# Altium schematic sheet [05] - CPU - PCIE.SchDoc
size A2; DocumentNumber: 5; SheetNumber: 5; SheetTotal: 20
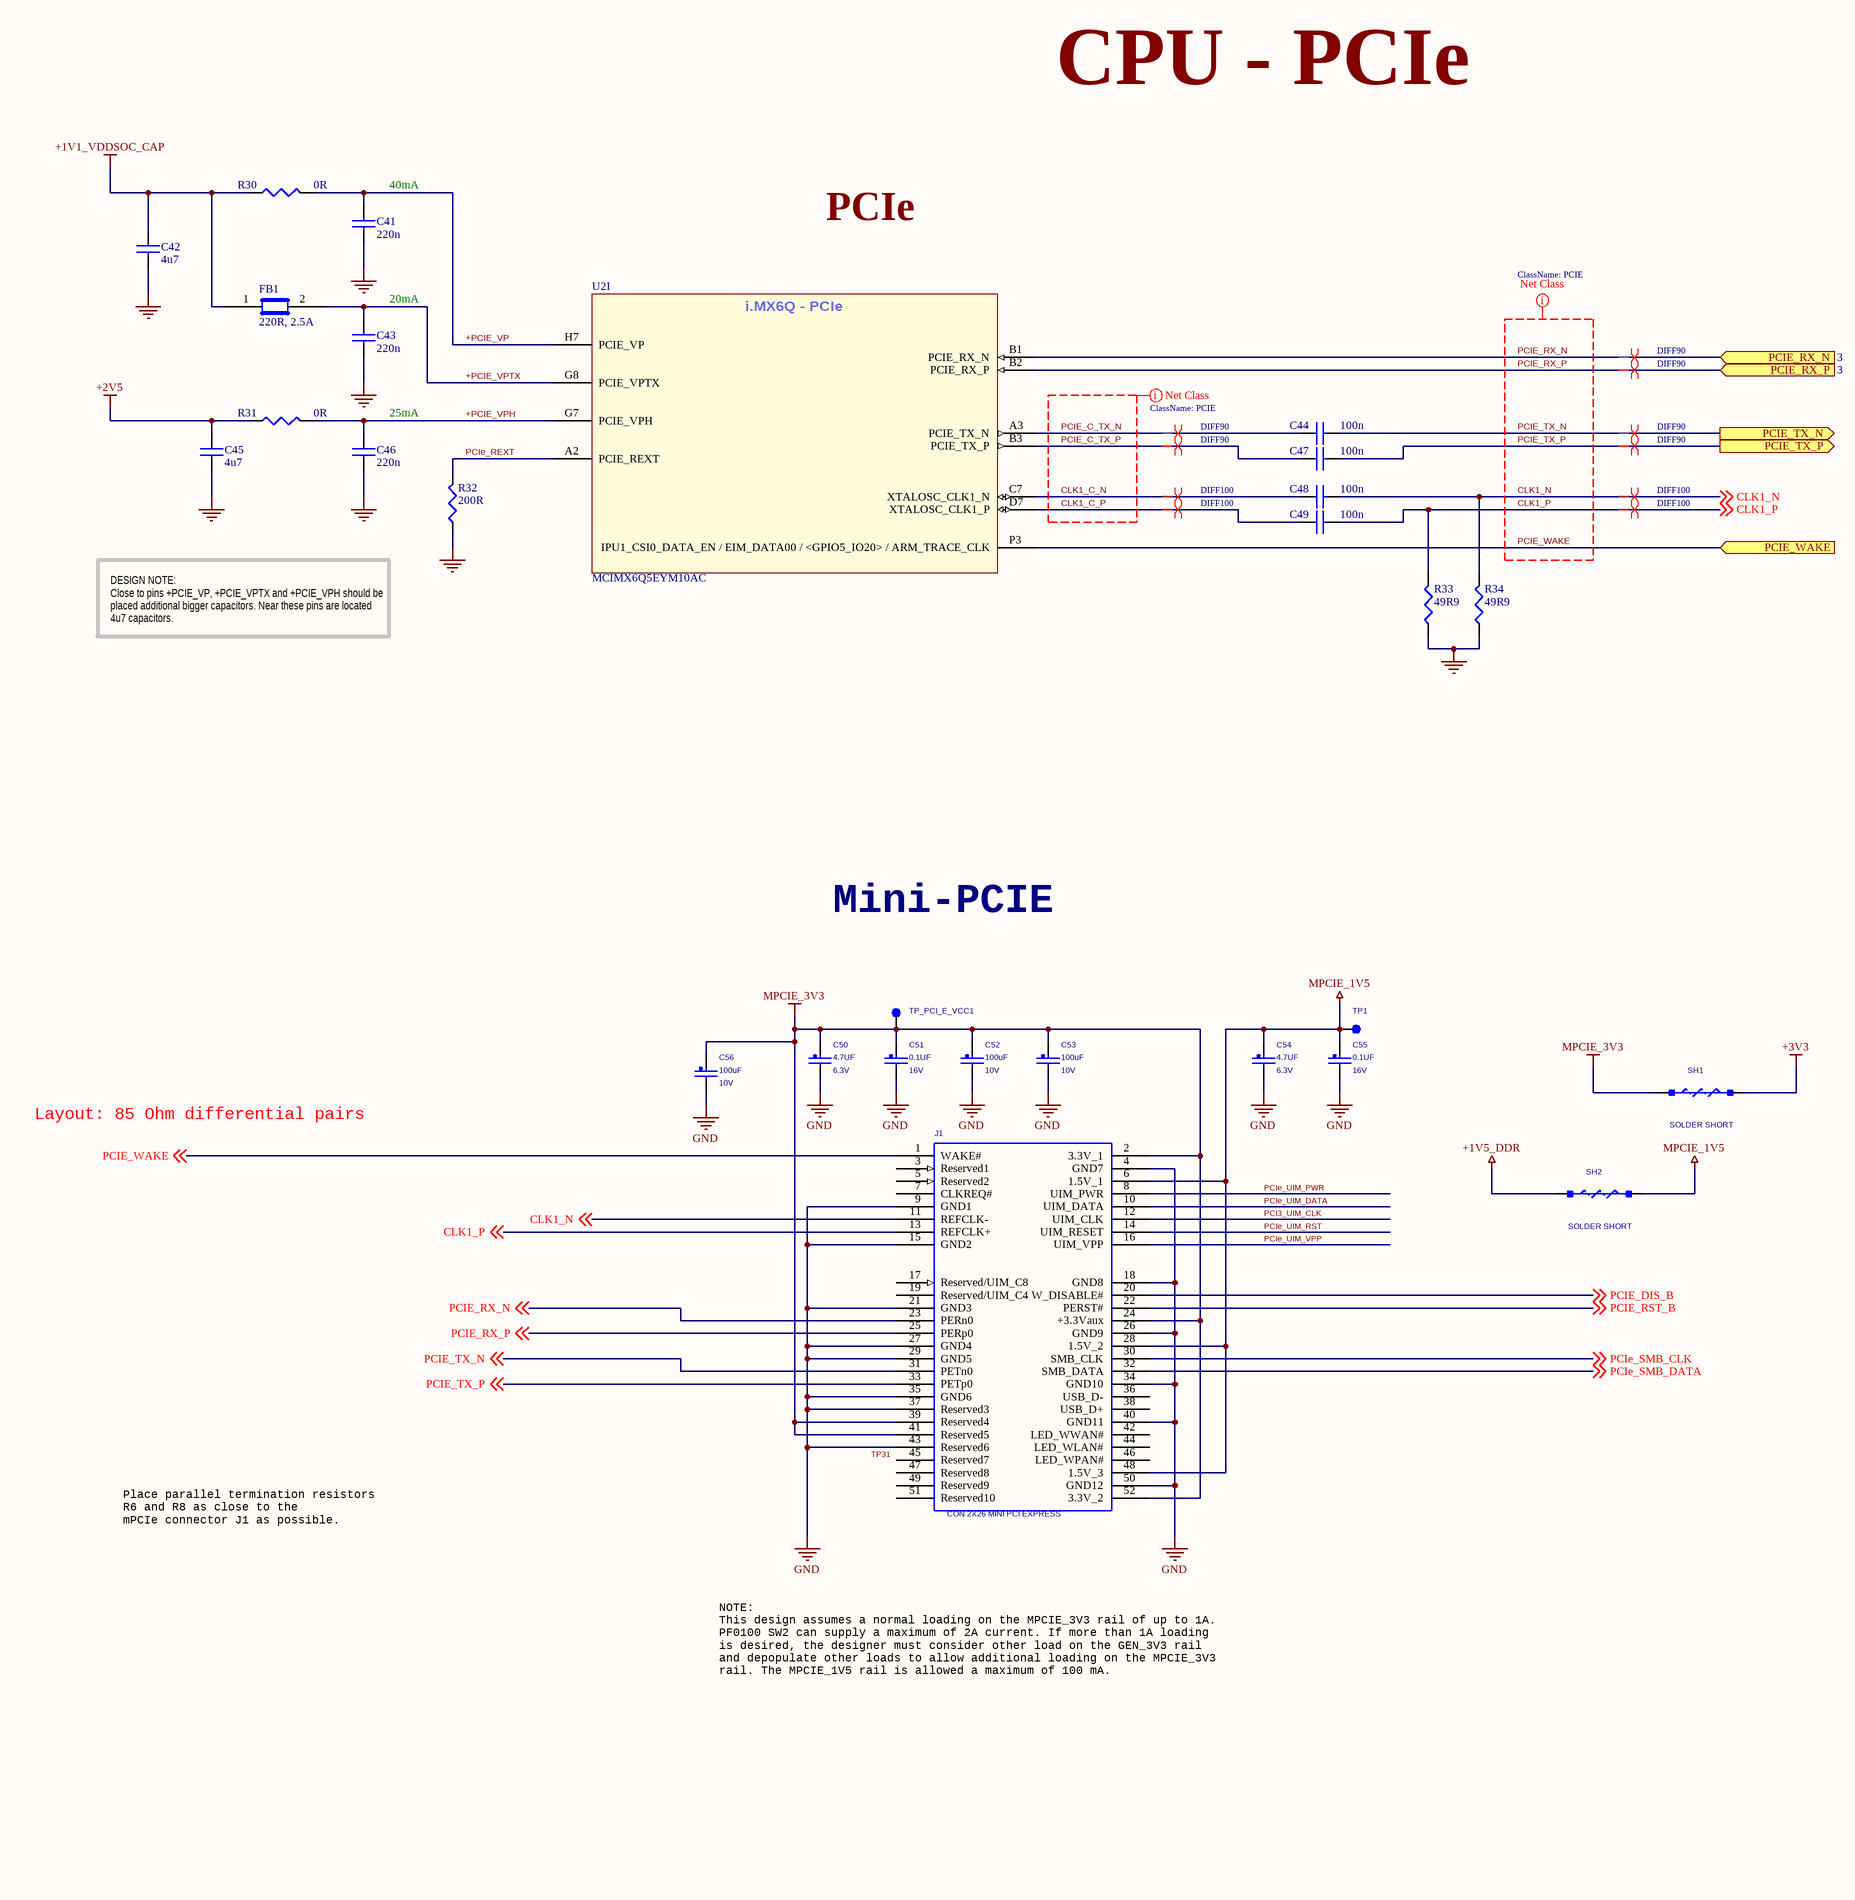
[diagram p0: [05] - CPU - PCIE.SchDoc, left]
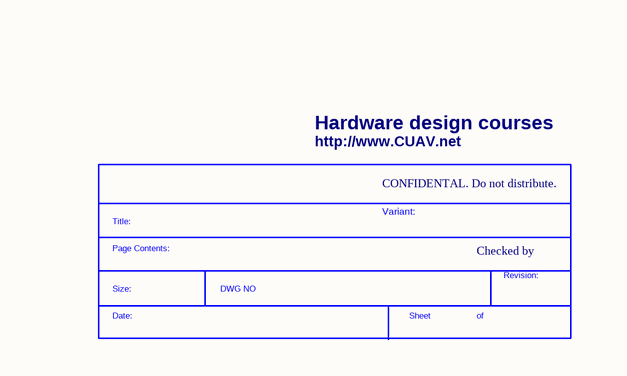
[diagram p1: [05] - CPU - PCIE.SchDoc, right]

## Parts
*  SDTitleBlock  (value not drawn)  (graphical)
C41  220n  [C0402]
C42  4u7  [0603c]
C43  220n  [C0402]
C44  100n  [C0402]
C45  4u7  [C0402]
C46  220n  [C0402]
C47  100n  [C0402]
C48  100n  [0402cap]
C49  100n  [0402cap]
C50  4.7UF  WVDC: 6.3V  [0603c]
C51  0.1UF  WVDC: 16V  [0402_CC]
C52  100uF  WVDC: 10V  [1206_CC]
C53  100uF  WVDC: 10V  [1206_CC]
C54  4.7UF  WVDC: 6.3V  [0603c]
C55  0.1UF  WVDC: 16V  [0402cap]
C56  100uF  WVDC: 10V  [1206_CC]
FB1  220R, 2.5A  [0402r]
J1  CON 2X26 MINI PCI EXPRESS  [0679100002]
R30  0R  [R0402]
R31  0R  [R0402]
R32  200R  [R0402]
R33  49R9  [R0402]
R34  49R9  [R0402]
SH1  SOLDER SHORT  [0805L]
SH2  SOLDER SHORT  [0805L]
TP1  TEST POINT  [C035S]  (value not drawn)
TP_PCI_E_VCC1  TEST POINT  [C035S]  (value not drawn)
U2  MCIMX6Q5EYM10AC  [PBGA624]  (part I of 15)

## Ports
PCIE_RX_N (in, see 3), PCIE_RX_P (in, see 3), PCIE_TX_N (out), PCIE_TX_P (out), PCIE_WAKE (in)

## Nets
+1V1_VDDSOC_CAP: C42.1 FB1.1 R30.1
+1V5_DDR: SH2.1
+2V5: C45.1 R31.1
+3V3: SH1.2
GND: C41.2 C42.2 C43.2 C45.2 C46.2 C50.2 C51.2 C52.2 C53.2 C54.2 C55.2 C56.2 J1.4(GND7) J1.9(GND1) J1.15(GND2) J1.18(GND8) J1.21(GND3) J1.26(GND9) J1.27(GND4) J1.29(GND5) J1.34(GND10) J1.35(GND6) J1.37(Reserved3) J1.40(GND11) J1.43(Reserved6) J1.50(GND12) R32.1 R33.1 R34.1
MPCIE_1V5: C54.1 C55.1 J1.6(1.5V_1) J1.28(1.5V_2) J1.48(1.5V_3) SH2.2 TP1.1(Pin1)
MPCIE_3V3: C50.1 C51.1 C52.1 C53.1 C56.1 J1.2(3.3V_1) J1.24(+3.3Vaux) J1.39(Reserved4) J1.41(Reserved5) J1.52(3.3V_2) SH1.1 TP_PCI_E_VCC1.1(Pin1)
+PCIE_VP: C41.1 R30.2 U2.H7(PCIE_VP)
+PCIE_VPH: C46.1 R31.2 U2.G7(PCIE_VPH)
+PCIE_VPTX: C43.1 FB1.2 U2.G8(PCIE_VPTX)
CLK1_C_N: C48.1 U2.C7(XTALOSC_CLK1_N)
CLK1_C_P: C49.1 U2.D7(XTALOSC_CLK1_P)
CLK1_N: C48.2 J1.11(REFCLK-) R34.2 ; off-sheet CLK1_N
CLK1_P: C49.2 J1.13(REFCLK+) R33.2 ; off-sheet CLK1_P
PCI3_UIM_CLK: J1.12(UIM_CLK)
PCIE_C_TX_N: C44.1 U2.A3(PCIE_TX_N)
PCIE_C_TX_P: C47.1 U2.B3(PCIE_TX_P)
PCIE_DIS_B: J1.20(W_DISABLE#) ; off-sheet PCIE_DIS_B
PCIe_REXT: R32.2 U2.A2(PCIE_REXT)
PCIE_RST_B: J1.22(PERST#) ; off-sheet PCIE_RST_B
PCIE_RX_N: J1.23(PERn0) U2.B1(PCIE_RX_N) ; off-sheet PCIE_RX_N, port PCIE_RX_N
PCIE_RX_P: J1.25(PERp0) U2.B2(PCIE_RX_P) ; off-sheet PCIE_RX_P, port PCIE_RX_P
PCIe_SMB_CLK: J1.30(SMB_CLK) ; off-sheet PCIe_SMB_CLK
PCIe_SMB_DATA: J1.32(SMB_DATA) ; off-sheet PCIe_SMB_DATA
PCIE_TX_N: C44.2 J1.31(PETn0) ; off-sheet PCIE_TX_N, port PCIE_TX_N
PCIE_TX_P: C47.2 J1.33(PETp0) ; off-sheet PCIE_TX_P, port PCIE_TX_P
PCIe_UIM_DATA: J1.10(UIM_DATA)
PCIe_UIM_PWR: J1.8(UIM_PWR)
PCIe_UIM_RST: J1.14(UIM_RESET)
PCIe_UIM_VPP: J1.16(UIM_VPP)
PCIE_WAKE: J1.1(WAKE#) U2.P3(IPU1_CSI0_DATA_EN_/_EIM_DATA00_/_<GPIO5_IO20>_/_ARM_TRACE_CLK) ; off-sheet PCIE_WAKE, port PCIE_WAKE

Not connected (* = marked no-connect by the designer): J1 3(Reserved1) 5(Reserved2) 7(CLKREQ#) 17(Reserved/UIM_C8) 19(Reserved/UIM_C4) 36(USB_D-) 38(USB_D+) 42(LED_WWAN#) 44(LED_WLAN#) 45(Reserved7) 46(LED_WPAN#) 47(Reserved8) 49(Reserved9) 51(Reserved10)

## Layout directives
differential pair; net class DIFF100: CLK1_C_N, CLK1_C_P, CLK1_N, CLK1_P
differential pair; net class DIFF90: PCIE_C_TX_N, PCIE_C_TX_P, PCIE_RX_N, PCIE_RX_P, PCIE_TX_N, PCIE_TX_P
net class PCIE: CLK1_C_N, CLK1_C_P, CLK1_N, CLK1_P, PCIE_C_TX_N, PCIE_C_TX_P, PCIE_RX_N, PCIE_RX_P, PCIE_TX_N, PCIE_TX_P, PCIE_WAKE

## Notes on the sheet
- CPU - PCIe
- (near C41) 40mA
- PCIe
- (near C43) 20mA
- (near C46) 25mA
- DESIGN NOTE:
  Close to pins +PCIE_VP, +PCIE_VPTX and +PCIE_VPH should be placed additional bigger capacitors. Near these pins are located 4u7 capacitors.
- Mini-PCIE
- Layout: 85 Ohm differential pairs
- Place parallel termination resistors
  R6 and R8 as close to the
  mPCIe connector J1 as possible.
- NOTE:
  This design assumes a normal loading on the MPCIE_3V3 rail of up to 1A.
  PF0100 SW2 can supply a maximum of 2A current. If more than 1A loading
  is desired, the designer must consider other load on the GEN_3V3 rail
  and depopulate other loads to allow additional loading on the MPCIE_3V3
  rail. The MPCIE_1V5 rail is allowed a maximum of 100 mA.
- Hardware design courses
- http://www.CUAV.net
- CONFIDENTAL. Do not distribute.
- CLOCKS (CPU & PCIE)
- Variant:
- Checked by
- Labels drawn without touching a wire or pin: TP31
- (in symbol MCIMX6Q5EYM10AC, part I) i.MX6Q - PCIe
- (in symbol SDTitleBlock) Title:; Page Contents:; Revision:; Size:; DWG NO; Date:; Sheet; of

## Library data of the parts
C41 C43 C46 = C1005X5R1E224M: CAP CER .22UF 25V X5R 20% 0402; Manufacturer: TDK Corporation; Capacitance: 0.22礔; Value: 220nF; .Checked PCB: used; Tolerance: ?0%; Category: Capacitors; Supplier Part Number: 445-5945-1-ND; Manufacturer Part Number: C1005X5R1E224M; Operating Temperature: -55癈 ~ 85癈; Package / Case: 0402 (1005 Metric); Price 1k [$]: 0.02600; .Checked SCH: used; Voltage - Rated: 25V; Supplier: Digikey; Supplier 1: Digi-Key; Supplier Part Number 1: 445-5945-1-ND; RoHS: RoHS Compliant; Stock 1: 54593; Pricing 1: 1=0.3, 10=0.2, 100=0.08, 250=0.05752, 500=0.041, 1000=0.03 (USD); Temperature Coefficient: X5R; Mounting Type: Surface Mount, MLCC; Applications: General Purpose; Ratings: -; Size / Dimension: 0.039" L x 0.020" W (1.00mm x 0.50mm); Height - Seated (Max): -; Thickness (Max): 0.022" (0.55mm); Lead Spacing: -; Features: -; Packaging: Cut Tape (CT); Lead Style: -; ComponentLink1URL: http://www.tdk.co.jp/tefe02/e412_c.pdf; ComponentLink1Description: http://www.tdk.co.jp/tefe02/e412_c.pdf
C42 C45 = C1005X5R1A475M: CAP CER 4.7UF 10V 20% X5R 0402; Manufacturer: TDK Corporation; Capacitance: 4.7礔; Tolerance: ?0%; .Checked PCB: RF; Supplier 1: Digi-Key; Supplier Part Number 1: 445-8023-1-ND; Manufacturer Part Number: C1005X5R1A475M; RoHS: RoHS Compliant; Category: Capacitors; Stock 1: 10140; Pricing 1: 1=0.53, 10=0.415, 100=0.25, 250=0.18752, 500=0.16, 1000=0.125, 5000=0.095 (USD); Voltage - Rated: 10V; Temperature Coefficient: X5R; Mounting Type: Surface Mount, MLCC; Operating Temperature: -55癈 ~ 85癈; Applications: General Purpose; Ratings: -; Package / Case: 0402 (1005 Metric); Size / Dimension: 0.039" L x 0.020" W (1.00mm x 0.50mm); Height - Seated (Max): -; Thickness (Max): -; Lead Spacing: -; Features: -; Packaging: Cut Tape (CT); Lead Style: -; ComponentLink1URL: http://www.tdk.com/pdf/general_B11.pdf; ComponentLink1Description: http://www.tdk.com/pdf/general_B11.pdf; .Checked SCH: RF
C44 C47-C49 = C1005X5R1H104K: CAP CER .10UF 50V X5R 10% 0402; Manufacturer: TDK Corporation; Capacitance: 0.1礔; Value: 100nF; .Checked PCB: used; Tolerance: ?0%; Category: Capacitors; Supplier Part Number: 445-5942-1-ND; Manufacturer Part Number: C1005X5R1H104K; Operating Temperature: -55癈 ~ 85癈; Package / Case: 0402 (1005 Metric); Price 1k [$]: 0.02340; .Checked SCH: used; Voltage - Rated: 50V; Supplier: Digikey; Supplier 1: Digi-Key; Supplier Part Number 1: 445-5942-1-ND; RoHS: RoHS Compliant; Stock 1: 106926; Pricing 1: 1=0.27, 10=0.18, 100=0.072, 250=0.05176, 500=0.0369, 1000=0.027 (USD); Temperature Coefficient: X5R; Mounting Type: Surface Mount, MLCC; Applications: General Purpose; Ratings: -; Size / Dimension: 0.039" L x 0.020" W (1.00mm x 0.50mm); Height - Seated (Max): -; Thickness (Max): 0.022" (0.55mm); Lead Spacing: -; Features: -; Packaging: Cut Tape (CT); Lead Style: -; ComponentLink1URL: http://www.tdk.co.jp/tefe02/e412_c.pdf; ComponentLink1Description: http://www.tdk.co.jp/tefe02/e412_c.pdf
C50 = CAP_NP: CAP CER 4.7UF 6.3V 10% X5R 0603; CLASS: DISCRETE; PRIORITY_PN: 021-00280; FPLIST: CC0603_OV,CC0603,0603_CC; CAD_APPROVED: Yes; MFG_PN01: C0603X5R6R3-475KNP; MFG_NAME01: VENKEL COMPANY; AGILE_PN: 150-75487; ROOM: MINIPCIE; SIGNAL_MODEL: DEFAULT_CAPACITOR_4.7e+06pF_2_1; HEIGHT: 1.016MM; ROHS: Yes; Tolerance: 10%; VOLTAGE: 6.3V
C51 = CAP_NP: CAP CER 0.1UF 16V 10% X7R 0402; CLASS: DISCRETE; AGILE_PN: 150-75182; MFG_NAME01: KEMET; MFG_PN01: C0402C104K4RAC; CAD_APPROVED: Yes; FPLIST: CC0402_25,CC0402_HD,0402_CC; PRIORITY_PN: 021-00196; ROOM: MINIPCIE; SIGNAL_MODEL: DEFAULT_CAPACITOR_100000pF_2_1; Tolerance: 10%; ROHS: Yes; HEIGHT: 0.635MM; VOLTAGE: 16V
C52 C53 = CAP_NP: CAP CER 100uF 10V 20% X5R 1206; CLASS: DISCRETE; AGILE_PN: 150-78880; MFG_NAME01: TDK; MFG_PN01: C3216X5R1A107M; CAD_APPROVED: Yes; FPLIST: CC1206_OV,CC1206,1206_CC; SIGNAL_MODEL: DEFAULT_CAPACITOR_1e+08pF_2_1; Tolerance: 20%; ROHS: Yes; HEIGHT: 1.9MM; VOLTAGE: 10V
C54 = CAP_NP: CAP CER 4.7UF 6.3V 10% X5R 0603; CLASS: DISCRETE; ROOM: MINIPCIE; AGILE_PN: 150-75487; MFG_NAME01: VENKEL COMPANY; MFG_PN01: C0603X5R6R3-475KNP; CAD_APPROVED: Yes; FPLIST: CC0603_OV,CC0603,0603_CC; PRIORITY_PN: 021-00280; SIGNAL_MODEL: DEFAULT_CAPACITOR_4.7e+06pF_2_1; Tolerance: 10%; ROHS: Yes; HEIGHT: 1.016MM; VOLTAGE: 6.3V
C55 = CAP_NP: CAP CER 0.1UF 16V 10% X7R 0402; CLASS: DISCRETE; ROOM: MINIPCIE; PRIORITY_PN: 021-00196; FPLIST: CC0402_25,CC0402_HD,0402_CC; CAD_APPROVED: Yes; MFG_PN01: C0402C104K4RAC; MFG_NAME01: KEMET; AGILE_PN: 150-75182; SIGNAL_MODEL: DEFAULT_CAPACITOR_100000pF_2_1; HEIGHT: 0.635MM; ROHS: Yes; Tolerance: 10%; VOLTAGE: 16V
C56 = CAP_NP: CAP CER 100uF 10V 20% X5R 1206; CLASS: DISCRETE; AGILE_PN: 150-78880; MFG_NAME01: TDK; MFG_PN01: C3216X5R1A107M; CAD_APPROVED: Yes; FPLIST: CC1206_OV,CC1206,1206_CC; Tolerance: 20%; ROHS: Yes; HEIGHT: 1.9MM; VOLTAGE: 10V
FB1 = BLM18SG221TN1D: FERRITE CHIP 220 OHM 2500MA 0603; Manufacturer: Murata Electronics North America; Impedance @ Frequency: 220 Ohm @ 100MHz; DC Resistance (DCR): 40 mOhm Max; Filter Type: Differential Mode - Single; Number of Lines: 1; .Checked PCB: RF; Supplier 1: Digi-Key; Supplier Part Number 1: 490-5225-1-ND; Manufacturer Part Number: BLM18SG221TN1D; RoHS: RoHS Compliant; Category: Filters; Stock 1: 54640; Pricing 1: 1=0.38, 10=0.282, 50=0.1646, 100=0.1316, 250=0.094, 500=0.06392, 1000=0.0517, 5000=0.04042 (USD); Current Rating: 2.5A; Package / Case: 0603 (1608 Metric); Mounting Type: Surface Mount; Packaging: Cut Tape (CT); Height (Max): 0.037" (0.95mm); Size / Dimension: 0.063" L x 0.031" W (1.60mm x 0.80mm); ComponentLink1URL: http://search.murata.co.jp/Ceramy/image/img/PDF/ENG/L0110S0100BLM18S.pdf; ComponentLink1Description: http://search.murata.co.jp/Ceramy/image/img/PDF/ENG/L0110S0100BLM18S.pdf; .Checked SCH: RF
J1 = MINI_PCI_LATCH_52P: CON 2X26 MINI PCI EXPRESS SMT 0.8MM SP 1136H; CLASS: IO; CAD_APPROVED: Yes; MFG_PN01: 679100002; MFG_NAME01: Molex; AGILE_PN: 211-78711; HEIGHT: 28.85MM; ROHS: Yes
R30 R31 = RC0402JR-070RL: RES 0.0 OHM 1/16W 0402 SMD; Manufacturer: Yageo; Resistance (Ohms): 0.0; Power (Watts): 0.063W, 1/16W; Tolerance: Jumper; .Checked PCB: used; Category: Resistors; Supplier Part Number: 311-0.0JRCT-ND; Manufacturer Part Number: RC0402JR-070RL; Package / Case: 0402 (1005 Metric); Price 1k [$]: 0.01389; Value: 0R; .Checked SCH: used; Supplier: Digikey; Supplier 1: Digi-Key; Supplier Part Number 1: 311-0.0JRCT-ND; RoHS: RoHS Compliant; Stock 1: 1106330; Pricing 1: 10=0.012, 50=0.009, 100=0.0069, 250=0.00512, 500=0.0038, 1000=0.00253 (USD); Composition: Thick Film; Features: -; Temperature Coefficient: -; Size / Dimension: 0.039" L x 0.020" W (1.00mm x 0.50mm); Height: 0.016" (0.40mm); Number of Terminations: 2; Packaging: Cut Tape (CT); ComponentLink1URL: http://www.yageo.com/documents/recent/PYu-RC0402_51_RoHS_L_6.pdf; ComponentLink1Description: http://www.yageo.com/documents/recent/PYu-RC0402_51_RoHS_L_6.pdf
R32 = CRCW0402200RFKED: RES 200 OHM 1/16W 1% 0402 SMD; Manufacturer: Vishay Dale; Resistance (Ohms): 200; Power (Watts): 0.063W, 1/16W; Temperature Coefficient: ?00ppm/癈; Tolerance: ?%; .Checked PCB: RF, used by MM; .Checked SCH: MM, checked by RF; .Creator: MM; Supplier 1: Digi-Key; Manufacturer Part Number: CRCW0402200RFKED; RoHS: RoHS Compliant; Category: Resistors; Stock 1: 251574; Pricing 1: 10=0.083, 50=0.0444, 200=0.0255, 1000=0.0174 (USD); Composition: Thick Film; Features: Automotive AEC-Q200 Qualified; Package / Case: 0402 (1005 Metric); Supplier Device Package: 0402 (1005 Metric); Size / Dimension: 0.039" L x 0.020" W (1.00mm x 0.50mm); Height: 0.016" (0.40mm); Number of Terminations: 2; Packaging: Cut Tape (CT); ComponentLink1URL: http://www.vishay.com/doc?20035; ComponentLink1Description: http://www.vishay.com/doc?20035; Supplier Part Number 1: 541-200LCT-ND
R33 R34 = RC0402FR-0749R9L: RES 49.9 OHM 1/16W 1% 0402 SMD; Manufacturer: Yageo; Resistance (Ohms): 49.9; Power (Watts): 0.063W, 1/16W; Tolerance: ?%; Value: 49.9R; .Checked PCB: used; Temperature Coefficient: ?00ppm/癈; Category: Resistors; Supplier Part Number: 311-49.9LRCT-ND; Manufacturer Part Number: RC0402FR-0749R9L; Package / Case: 0402 (1005 Metric); Price 1k [$]: 0.01421; .Checked SCH: used; Supplier: Digikey; Supplier 1: Digi-Key; Supplier Part Number 1: 311-49.9LRCT-ND; RoHS: RoHS Compliant; Stock 1: 235950; Pricing 1: 10=0.014, 50=0.0104, 100=0.0079, 250=0.00584, 500=0.00432, 1000=0.00288 (USD); Composition: Thick Film; Features: -; Size / Dimension: 0.039" L x 0.020" W (1.00mm x 0.50mm); Height: 0.016" (0.40mm); Number of Terminations: 2; Packaging: Cut Tape (CT); ComponentLink1URL: http://www.yageo.com/documents/recent/PYu-RC0402_51_RoHS_L_6.pdf; ComponentLink1Description: http://www.yageo.com/documents/recent/PYu-RC0402_51_RoHS_L_6.pdf
SH1 SH2 = RES_SHORT-2: SOLDER SHORT 0805  SMT NO PART TO ORDER; CLASS: DISCRETE; FPLIST: SH0805,SH0805CUST,SH0805_40; CAD_APPROVED: Yes; ASSY_OPT: DNP; MFG_PN01: SOLDER_SHORT_0805; MFG_NAME01: NOTACOMPONENT; AGILE_PN: 470-80202; ROHS: Yes
TP1 TP_PCI_E_VCC1 = Test pad: TEST POINT PAD 35 MIL SMT, NO PART TO ORDER; CLASS: IC; CAD_APPROVED: Yes; ASSY_OPT: DNP; MFG_PN01: NA; AGILE_PN: 280-75148; HEIGHT: 0.1 MM; ROHS: Yes; MFG_NAME01: NA
U2 = MCIMX6Q5EYM10AC: IC MCU 32BIT ARM QUAD 624FCBGA; Manufacturer: Freescale Semiconductor; Core Processor: ARM?Cortex?A9; Core Size: 32-Bit Quad-Core; Speed: 1.0GHz; Connectivity: CAN, EBI/EMI, ESAI, Ethernet, GPMI, I2C, MMC/SD, PCI, SATA, SPI, UART, USB, USB OTG; Peripherals: DMA, HDMI, I2S/SSI/AC97, MIPI CSI, MIMI DSI, MIPI HIS, PWM, WDT; Number of I /O: 224; Program Memory Type: External Program Memory; RAM Size: 256K x 8; Voltage - Supply (Vcc/Vdd): 0.925 V ~ 1.5 V; Oscillator Type: Internal; .Creator: MM; .Checked PCB: MM, checked by RF; Supplier 1: Digi-Key; Manufacturer Part Number: MCIMX6Q5EYM10AC; RoHS: RoHS Compliant; Category: Integrated Circuits (ICs); Stock 1: 0; Pricing 1: 1=54.98, 10=51.922, 25=48.868, 100=30.5424 (USD); Program Memory Size: -; EEPROM Size: -; Data Converters: -; Operating Temperature: -20癈 ~ 105癈; Package / Case: 624-FBGA, FCBGA; Packaging: Tray; ComponentLink1URL: http://cache.freescale.com/files/32bit/doc/data_sheet/IMX6DQCEC.pdf; ComponentLink1Description: http://cache.freescale.com/files/32bit/doc/data_sheet/IMX6DQCEC.pdf; Supplier Part Number 1: MCIMX6Q5EYM10AC-ND; .Checked SCH: MM